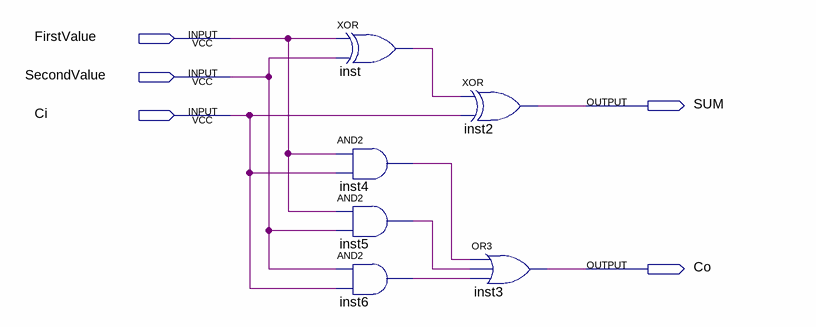
[diagram p0: schematic sheet]
// Quartus schematic FA.bdf as structural Verilog: 6 symbols, 5 pins
module FA (
  input  FirstValue,
  input  SecondValue,
  input  Ci,
  output SUM,
  output Co
);

  wire inst4_out, inst5_out, inst6_out, inst_out;

  xor inst (inst_out, FirstValue, SecondValue);
  and inst4 (inst4_out, FirstValue, Ci);
  and inst5 (inst5_out, FirstValue, SecondValue);
  and inst6 (inst6_out, SecondValue, Ci);
  xor inst2 (SUM, inst_out, Ci);
  or inst3 (Co, inst4_out, inst5_out, inst6_out);
endmodule
